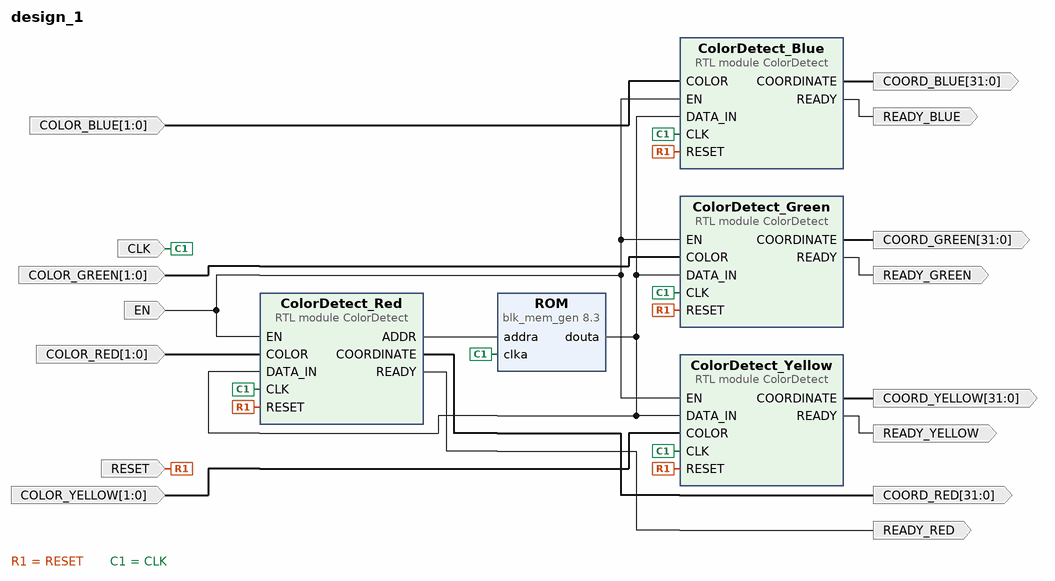
[diagram p0: block diagram of the top level]
# Vivado block design design_1, Vivado 2016.2
create_bd_design design_1

create_bd_port -dir I -from 1 -to 0 COLOR_RED
create_bd_port -dir I -from 1 -to 0 COLOR_GREEN
create_bd_port -dir I -from 1 -to 0 COLOR_BLUE
create_bd_port -dir I -from 1 -to 0 COLOR_YELLOW
create_bd_port -dir O -from 31 -to 0 COORD_RED
create_bd_port -dir O READY_RED
create_bd_port -dir O -from 31 -to 0 COORD_GREEN
create_bd_port -dir O READY_GREEN
create_bd_port -dir O -from 31 -to 0 COORD_BLUE
create_bd_port -dir O READY_BLUE
create_bd_port -dir O -from 31 -to 0 COORD_YELLOW
create_bd_port -dir O READY_YELLOW
create_bd_port -dir I -type rst RESET
create_bd_port -dir I -type clk CLK
create_bd_port -dir I EN

create_bd_cell -type ip -vlnv xilinx.com:ip:blk_mem_gen:8.3 ROM
set_property -dict [list \
  CONFIG.Memory_Type Single_Port_ROM \
  CONFIG.Enable_32bit_Address false \
  CONFIG.Write_Width_A 24 \
  CONFIG.Write_Depth_A 14400 \
  CONFIG.Enable_A Always_Enabled \
  CONFIG.Register_PortA_Output_of_Memory_Primitives false \
  CONFIG.Load_Init_File true \
  CONFIG.Coe_File rom_data.coe \
  CONFIG.Use_RSTA_Pin false \
  CONFIG.Port_A_Write_Rate 0 \
  CONFIG.use_bram_block Stand_Alone \
] [get_bd_cells ROM]
create_bd_cell -type module -reference ColorDetect ColorDetect_Red
create_bd_cell -type module -reference ColorDetect ColorDetect_Yellow
create_bd_cell -type module -reference ColorDetect ColorDetect_Blue
create_bd_cell -type module -reference ColorDetect ColorDetect_Green

# ---- connections ----

connect_bd_net -net COLOR_1 [get_bd_ports COLOR_RED] [get_bd_pins ColorDetect_Red/COLOR]
connect_bd_net -net COLOR_1_1 [get_bd_ports COLOR_GREEN] [get_bd_pins ColorDetect_Green/COLOR]
connect_bd_net -net COLOR_2_1 [get_bd_ports COLOR_BLUE] [get_bd_pins ColorDetect_Blue/COLOR]
connect_bd_net -net COLOR_3_1 [get_bd_ports COLOR_YELLOW] [get_bd_pins ColorDetect_Yellow/COLOR]
connect_bd_net [get_bd_pins ColorDetect_Red/ADDR] [get_bd_pins ROM/addra]
connect_bd_net [get_bd_pins ColorDetect_Red/COORDINATE] [get_bd_ports COORD_RED]
connect_bd_net [get_bd_pins ColorDetect_Red/READY] [get_bd_ports READY_RED]
connect_bd_net [get_bd_pins ColorDetect_Green/COORDINATE] [get_bd_ports COORD_GREEN]
connect_bd_net [get_bd_pins ColorDetect_Green/READY] [get_bd_ports READY_GREEN]
connect_bd_net [get_bd_pins ColorDetect_Blue/COORDINATE] [get_bd_ports COORD_BLUE]
connect_bd_net [get_bd_pins ColorDetect_Blue/READY] [get_bd_ports READY_BLUE]
connect_bd_net [get_bd_pins ColorDetect_Yellow/COORDINATE] [get_bd_ports COORD_YELLOW]
connect_bd_net [get_bd_pins ColorDetect_Yellow/READY] [get_bd_ports READY_YELLOW]
connect_bd_net [get_bd_ports RESET] \
  [get_bd_pins ColorDetect_Red/RESET] [get_bd_pins ColorDetect_Yellow/RESET] [get_bd_pins ColorDetect_Blue/RESET] \
  [get_bd_pins ColorDetect_Green/RESET]
connect_bd_net [get_bd_ports CLK] \
  [get_bd_pins ColorDetect_Red/CLK] [get_bd_pins ROM/clka] [get_bd_pins ColorDetect_Yellow/CLK] \
  [get_bd_pins ColorDetect_Blue/CLK] [get_bd_pins ColorDetect_Green/CLK]
connect_bd_net [get_bd_ports EN] \
  [get_bd_pins ColorDetect_Red/EN] [get_bd_pins ColorDetect_Yellow/EN] [get_bd_pins ColorDetect_Blue/EN] \
  [get_bd_pins ColorDetect_Green/EN]
connect_bd_net [get_bd_pins ROM/douta] \
  [get_bd_pins ColorDetect_Red/DATA_IN] [get_bd_pins ColorDetect_Yellow/DATA_IN] [get_bd_pins ColorDetect_Blue/DATA_IN] \
  [get_bd_pins ColorDetect_Green/DATA_IN]

validate_bd_design
save_bd_design
